# Altium schematic sheet GTM_CANconnector.SchDoc
size A4
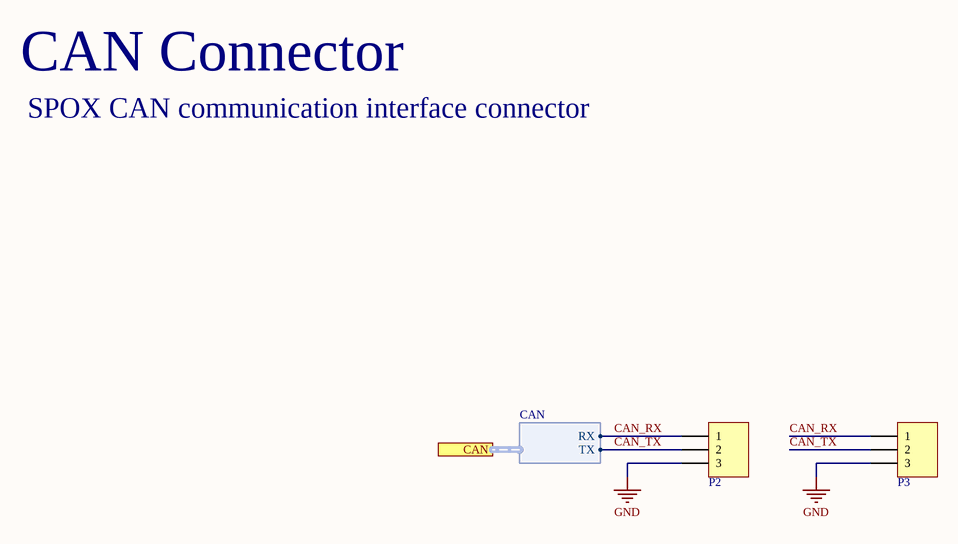
[diagram p0: GTM_CANconnector.SchDoc]

## Parts
P2  HDR1X3  [HDR1X3]  (value not drawn)
P3  Doubled Connector  [HDR1X3]  (value not drawn)

## Ports
CAN (harness CAN)

## Harnesses
CAN: RX, TX

## Nets
GND: P2.3 P3.3
CAN_RX: P2.1 P3.1 ; port CAN.RX
CAN_TX: P2.2 P3.2 ; port CAN.TX

## Notes on the sheet
- CAN Connector
- SPOX CAN communication interface connector
- Project
- Rev.
- Title
- Drawn by
- Date
- Sheet
- of
- Checked by

## Library data of the parts
P2 P3 = HDR1X3: Header, 3-Pin; LatestRevisionDate: 17-Jul-2002; LatestRevisionNote: Re-released for DXP Platform.; Publisher: Altium Limited